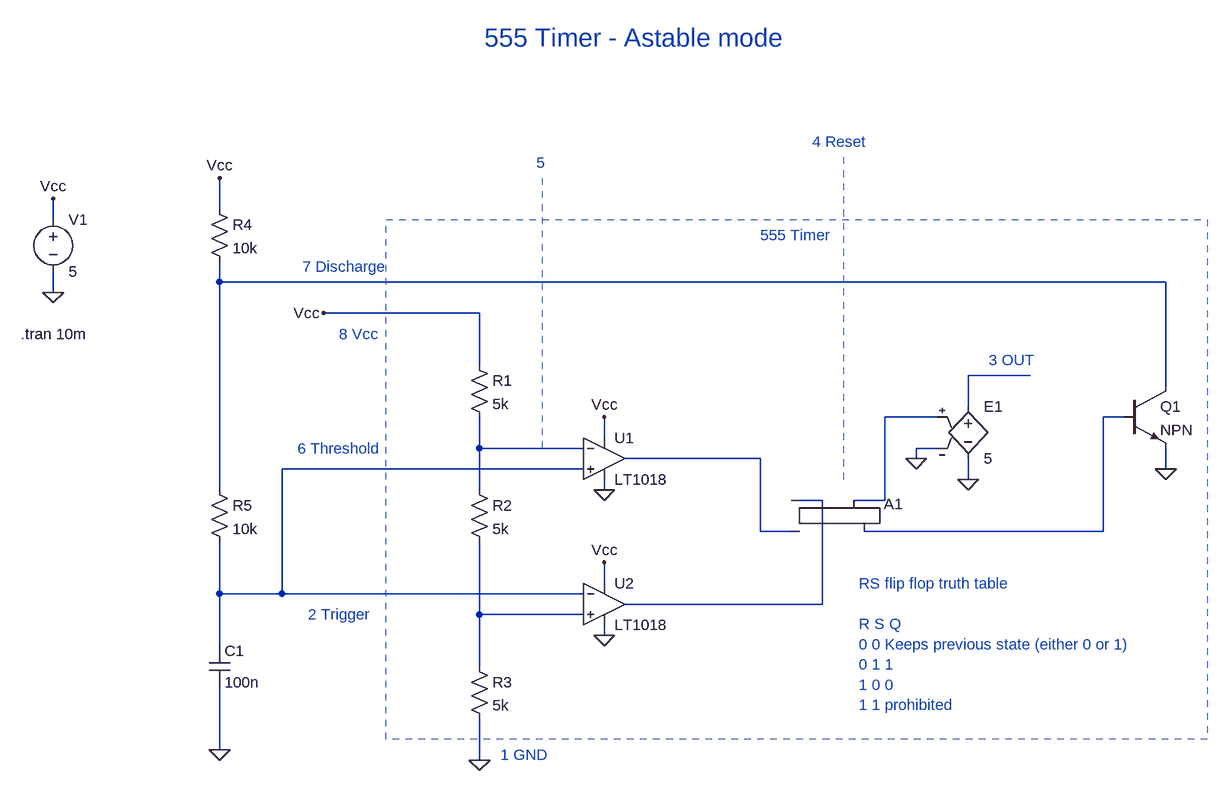
[diagram p0: schematic 555 - Astable mode.asc]
555 - Astable mode.asc, the LTspice schematic file:
Version 4
SHEET 1 1012 680
WIRE -512 -368 -512 -416
WIRE -768 -352 -768 -384
WIRE -512 -256 -512 -288
WIRE 944 -256 -512 -256
WIRE -768 -240 -768 -272
WIRE -112 -208 -352 -208
WIRE -112 -128 -112 -208
WIRE 736 -112 640 -112
WIRE 944 -96 944 -256
WIRE 640 -64 640 -112
WIRE 592 -48 512 -48
WIRE 880 -48 848 -48
WIRE 80 -16 80 -48
WIRE -112 0 -112 -48
WIRE 48 0 -112 0
WIRE 592 0 560 0
WIRE 320 16 112 16
WIRE 560 16 560 0
WIRE 48 32 -416 32
WIRE 944 32 944 0
WIRE 640 48 640 16
WIRE -512 64 -512 -256
WIRE -112 64 -112 0
WIRE 80 64 80 48
WIRE 416 80 368 80
WIRE 512 80 512 -48
WIRE 512 80 464 80
WIRE 320 128 320 16
WIRE 368 128 320 128
WIRE 848 128 848 -48
WIRE 848 128 480 128
WIRE 80 208 80 176
WIRE -512 224 -512 144
WIRE -416 224 -416 32
WIRE -416 224 -512 224
WIRE 48 224 -416 224
WIRE 416 240 416 80
WIRE 416 240 112 240
WIRE -112 256 -112 144
WIRE 48 256 -112 256
WIRE 80 288 80 272
WIRE -512 304 -512 224
WIRE -112 336 -112 256
WIRE -512 464 -512 368
WIRE -112 480 -112 416
FLAG -512 464 0
FLAG -112 480 0
FLAG -768 -240 0
FLAG 80 64 0
FLAG 80 288 0
FLAG -768 -384 Vcc
FLAG -512 -416 Vcc
FLAG -352 -208 Vcc
FLAG 80 -48 Vcc
FLAG 80 176 Vcc
FLAG 944 32 0
FLAG 560 16 0
FLAG 640 48 0
SYMBOL Digital\\srflop 416 32 R0
SYMATTR InstName A1
SYMBOL res -128 -144 R0
SYMATTR InstName R1
SYMATTR Value 5k
SYMBOL res -128 48 R0
SYMATTR InstName R2
SYMATTR Value 5k
SYMBOL res -128 320 R0
SYMATTR InstName R3
SYMATTR Value 5k
SYMBOL res -528 -384 R0
SYMATTR InstName R4
SYMATTR Value 10k
SYMBOL res -528 48 R0
SYMATTR InstName R5
SYMATTR Value 10k
SYMBOL cap -528 304 R0
SYMATTR InstName C1
SYMATTR Value 100n
SYMBOL Comparators\\LT1018 80 16 R0
SYMATTR InstName U1
SYMBOL Comparators\\LT1018 80 240 R0
SYMATTR InstName U2
SYMBOL voltage -768 -368 R0
WINDOW 123 0 0 Left 0
WINDOW 39 0 0 Left 0
SYMATTR InstName V1
SYMATTR Value 5
SYMBOL npn 880 -96 R0
SYMATTR InstName Q1
SYMBOL e 640 -80 R0
SYMATTR InstName E1
SYMATTR Value 5
TEXT -818 -176 Left 2 !.tran 10m
TEXT -80 472 Left 2 ;1 GND
TEXT -376 256 Left 2 ;2 Trigger
TEXT -392 0 Left 2 ;6 Threshold
TEXT -328 -176 Left 2 ;8 Vcc
TEXT 672 -136 Left 2 ;3 OUT
TEXT 320 -328 Left 2 ;555 Timer
TEXT -384 -280 Left 2 ;7 Discharge
TEXT 400 -472 Left 2 ;4 Reset
TEXT -24 -440 Left 2 ;5
TEXT -104 -632 Left 4 ;555 Timer - Astable mode
TEXT 472 208 Left 2 ;RS flip flop truth table\n \nR S Q\n0 0 Keeps previous state (either 0 or 1)\n0 1 1\n1 0 0\n1 1 prohibited
LINE Normal 448 -448 448 48 2
LINE Normal -16 -416 -16 0 2
RECTANGLE Normal 1008 448 -256 -352 2

The netlist it stands for:
* 555 - Astable mode.asc
A1 N008 N006 0 0 0 N004 N003 0 SRFLOP
R1 Vcc N005 5k
R2 N005 N009 5k
R3 N009 0 5k
R4 Vcc N001 10k
R5 N001 N007 10k
C1 N007 0 100n
XU1 N007 N005 Vcc 0 N006 LT1018  ; pins In+ In- V+ V- OUT
XU2 N009 N007 Vcc 0 N008 LT1018  ; pins In+ In- V+ V- OUT
V1 Vcc 0 5
Q1 N001 N004 0 0 NPN
E1 N002 0 N003 0 5
.model NPN NPN
.model PNP PNP
.lib standard.bjt
.tran 10m
* 1 GND
* 2 Trigger
* 6 Threshold
* 8 Vcc
* 3 OUT
* 555 Timer
* 7 Discharge
* 4 Reset
* 5
* 555 Timer - Astable mode
* RS flip flop truth table
* R S Q
* 0 0 Keeps previous state (either 0 or 1)
* 0 1 1
* 1 0 0
* 1 1 prohibited
.lib LTC1.lib
.backanno
.end